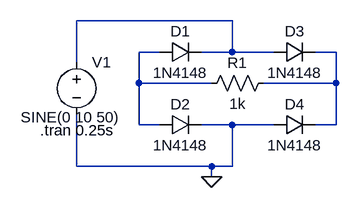
[diagram p0: schematic full_wave_rectifier_1.asc]
full_wave_rectifier_1.asc, the LTspice schematic file:
Version 4
SHEET 1 880 680
WIRE 224 64 -16 64
WIRE 112 112 80 112
WIRE 224 112 224 64
WIRE 224 112 176 112
WIRE 288 112 224 112
WIRE 384 112 352 112
WIRE -16 128 -16 64
WIRE 80 160 80 112
WIRE 192 160 80 160
WIRE 384 160 384 112
WIRE 384 160 272 160
WIRE 80 224 80 160
WIRE 112 224 80 224
WIRE 224 224 176 224
WIRE 288 224 224 224
WIRE 384 224 384 160
WIRE 384 224 352 224
WIRE -16 288 -16 208
WIRE 192 288 -16 288
WIRE 224 288 224 224
WIRE 224 288 192 288
WIRE 192 304 192 288
FLAG 192 304 0
SYMBOL voltage -16 112 R0
WINDOW 3 -86 100 Left 2
WINDOW 123 0 0 Left 0
WINDOW 39 0 0 Left 0
SYMATTR InstName V1
SYMATTR Value SINE(0 10 50)
SYMBOL diode 112 128 R270
WINDOW 0 32 32 VTop 2
WINDOW 3 0 32 VBottom 2
SYMATTR InstName D1
SYMATTR Value 1N4148
SYMBOL diode 112 240 R270
WINDOW 0 32 32 VTop 2
WINDOW 3 0 32 VBottom 2
SYMATTR InstName D2
SYMATTR Value 1N4148
SYMBOL diode 288 128 R270
WINDOW 0 32 32 VTop 2
WINDOW 3 0 32 VBottom 2
SYMATTR InstName D3
SYMATTR Value 1N4148
SYMBOL diode 288 240 R270
WINDOW 0 32 32 VTop 2
WINDOW 3 0 32 VBottom 2
SYMATTR InstName D4
SYMATTR Value 1N4148
SYMBOL res 288 144 R90
WINDOW 0 0 56 VBottom 2
WINDOW 3 32 56 VTop 2
SYMATTR InstName R1
SYMATTR Value 1k
TEXT -72 232 Left 2 !.tran 0.25s

The netlist it stands for:
* full_wave_rectifier_1.asc
V1 N001 0 SINE(0 10 50)
D1 N002 N001 1N4148
D2 N002 0 1N4148
D3 N001 N003 1N4148
D4 0 N003 1N4148
R1 N003 N002 1k
.model D D
.lib standard.dio
.tran 0.25s
.backanno
.end